# Altium project shpergl_light.PrjPcb
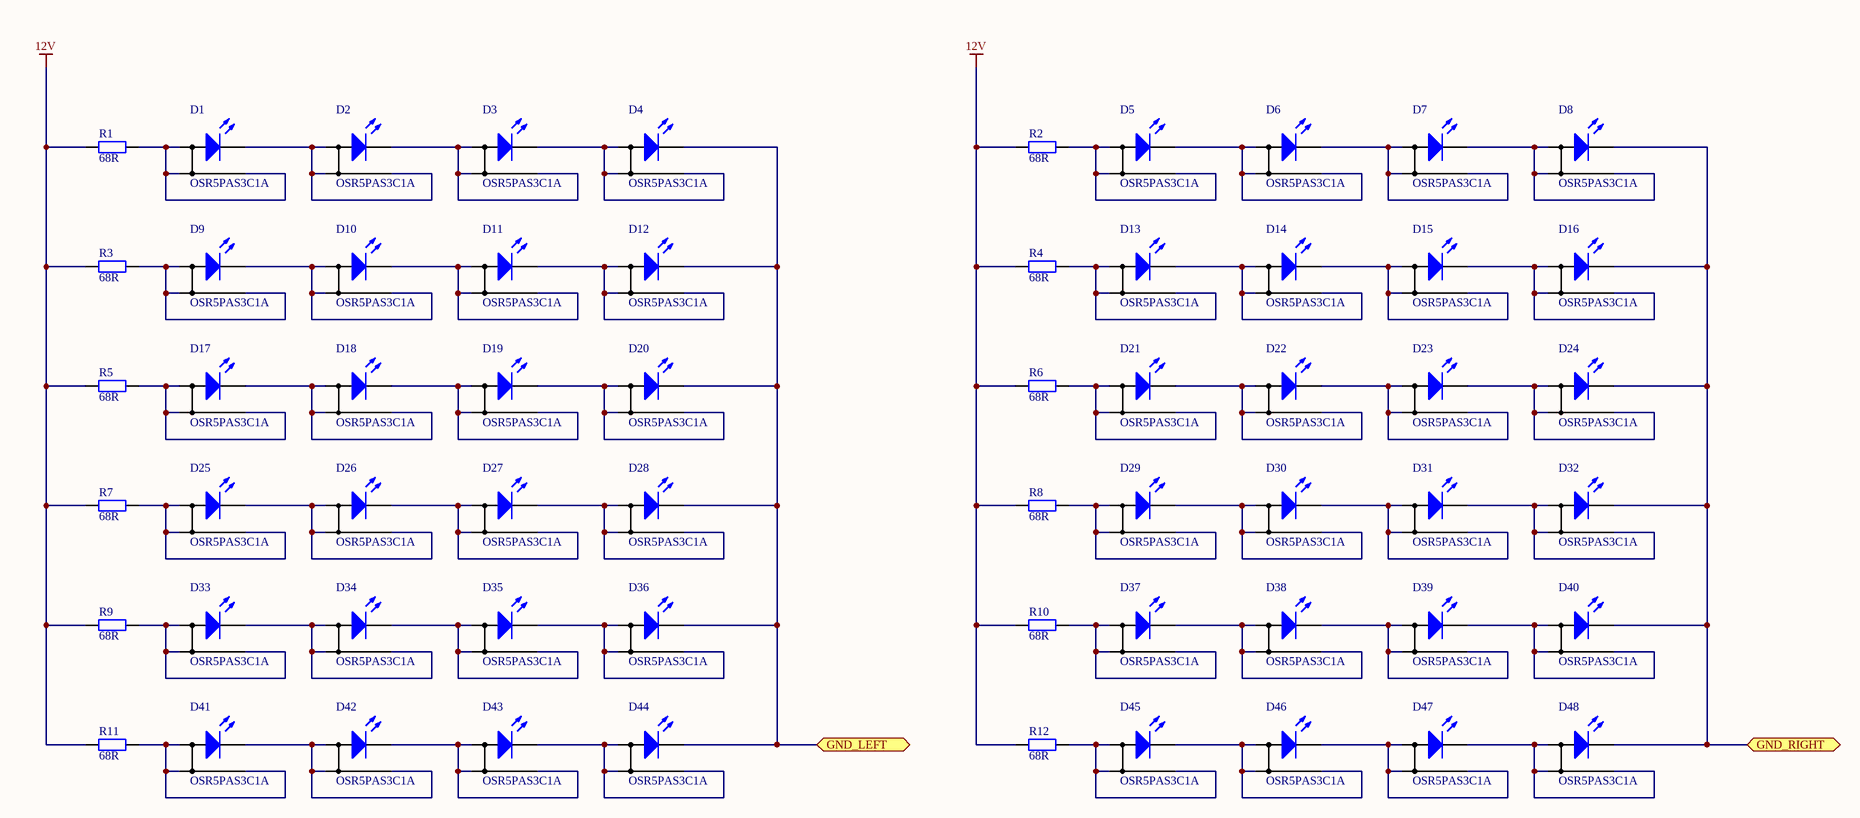
[diagram p0: backlight.SchDoc]
2 sheets, 107 parts. Net scope: flat (ports and power ports of the same name join across sheets).
Board file: backlight.PcbDoc
Sheets:
  backlight.SchDoc
  control_unit.SchDoc

## Sheet backlight.SchDoc
size A3

### Parts
D1  Value1: OSR5PAS3C1A  [DIO_Optosupply_OSR5PAS3C1A]  (hidden comment: DIO_LED_4pin_3528)
D2  Value1: OSR5PAS3C1A  [DIO_Optosupply_OSR5PAS3C1A]  (hidden comment: DIO_LED_4pin_3528)
D3  Value1: OSR5PAS3C1A  [DIO_Optosupply_OSR5PAS3C1A]  (hidden comment: DIO_LED_4pin_3528)
D4  Value1: OSR5PAS3C1A  [DIO_Optosupply_OSR5PAS3C1A]  (hidden comment: DIO_LED_4pin_3528)
D5  Value1: OSR5PAS3C1A  [DIO_Optosupply_OSR5PAS3C1A]  (hidden comment: DIO_LED_4pin_3528)
D6  Value1: OSR5PAS3C1A  [DIO_Optosupply_OSR5PAS3C1A]  (hidden comment: DIO_LED_4pin_3528)
D7  Value1: OSR5PAS3C1A  [DIO_Optosupply_OSR5PAS3C1A]  (hidden comment: DIO_LED_4pin_3528)
D8  Value1: OSR5PAS3C1A  [DIO_Optosupply_OSR5PAS3C1A]  (hidden comment: DIO_LED_4pin_3528)
D9  Value1: OSR5PAS3C1A  [DIO_Optosupply_OSR5PAS3C1A]  (hidden comment: DIO_LED_4pin_3528)
D10  Value1: OSR5PAS3C1A  [DIO_Optosupply_OSR5PAS3C1A]  (hidden comment: DIO_LED_4pin_3528)
D11  Value1: OSR5PAS3C1A  [DIO_Optosupply_OSR5PAS3C1A]  (hidden comment: DIO_LED_4pin_3528)
D12  Value1: OSR5PAS3C1A  [DIO_Optosupply_OSR5PAS3C1A]  (hidden comment: DIO_LED_4pin_3528)
D13  Value1: OSR5PAS3C1A  [DIO_Optosupply_OSR5PAS3C1A]  (hidden comment: DIO_LED_4pin_3528)
D14  Value1: OSR5PAS3C1A  [DIO_Optosupply_OSR5PAS3C1A]  (hidden comment: DIO_LED_4pin_3528)
D15  Value1: OSR5PAS3C1A  [DIO_Optosupply_OSR5PAS3C1A]  (hidden comment: DIO_LED_4pin_3528)
D16  Value1: OSR5PAS3C1A  [DIO_Optosupply_OSR5PAS3C1A]  (hidden comment: DIO_LED_4pin_3528)
D17  Value1: OSR5PAS3C1A  [DIO_Optosupply_OSR5PAS3C1A]  (hidden comment: DIO_LED_4pin_3528)
D18  Value1: OSR5PAS3C1A  [DIO_Optosupply_OSR5PAS3C1A]  (hidden comment: DIO_LED_4pin_3528)
D19  Value1: OSR5PAS3C1A  [DIO_Optosupply_OSR5PAS3C1A]  (hidden comment: DIO_LED_4pin_3528)
D20  Value1: OSR5PAS3C1A  [DIO_Optosupply_OSR5PAS3C1A]  (hidden comment: DIO_LED_4pin_3528)
D21  Value1: OSR5PAS3C1A  [DIO_Optosupply_OSR5PAS3C1A]  (hidden comment: DIO_LED_4pin_3528)
D22  Value1: OSR5PAS3C1A  [DIO_Optosupply_OSR5PAS3C1A]  (hidden comment: DIO_LED_4pin_3528)
D23  Value1: OSR5PAS3C1A  [DIO_Optosupply_OSR5PAS3C1A]  (hidden comment: DIO_LED_4pin_3528)
D24  Value1: OSR5PAS3C1A  [DIO_Optosupply_OSR5PAS3C1A]  (hidden comment: DIO_LED_4pin_3528)
D25  Value1: OSR5PAS3C1A  [DIO_Optosupply_OSR5PAS3C1A]  (hidden comment: DIO_LED_4pin_3528)
D26  Value1: OSR5PAS3C1A  [DIO_Optosupply_OSR5PAS3C1A]  (hidden comment: DIO_LED_4pin_3528)
D27  Value1: OSR5PAS3C1A  [DIO_Optosupply_OSR5PAS3C1A]  (hidden comment: DIO_LED_4pin_3528)
D28  Value1: OSR5PAS3C1A  [DIO_Optosupply_OSR5PAS3C1A]  (hidden comment: DIO_LED_4pin_3528)
D29  Value1: OSR5PAS3C1A  [DIO_Optosupply_OSR5PAS3C1A]  (hidden comment: DIO_LED_4pin_3528)
D30  Value1: OSR5PAS3C1A  [DIO_Optosupply_OSR5PAS3C1A]  (hidden comment: DIO_LED_4pin_3528)
D31  Value1: OSR5PAS3C1A  [DIO_Optosupply_OSR5PAS3C1A]  (hidden comment: DIO_LED_4pin_3528)
D32  Value1: OSR5PAS3C1A  [DIO_Optosupply_OSR5PAS3C1A]  (hidden comment: DIO_LED_4pin_3528)
D33  Value1: OSR5PAS3C1A  [DIO_Optosupply_OSR5PAS3C1A]  (hidden comment: DIO_LED_4pin_3528)
D34  Value1: OSR5PAS3C1A  [DIO_Optosupply_OSR5PAS3C1A]  (hidden comment: DIO_LED_4pin_3528)
D35  Value1: OSR5PAS3C1A  [DIO_Optosupply_OSR5PAS3C1A]  (hidden comment: DIO_LED_4pin_3528)
D36  Value1: OSR5PAS3C1A  [DIO_Optosupply_OSR5PAS3C1A]  (hidden comment: DIO_LED_4pin_3528)
D37  Value1: OSR5PAS3C1A  [DIO_Optosupply_OSR5PAS3C1A]  (hidden comment: DIO_LED_4pin_3528)
D38  Value1: OSR5PAS3C1A  [DIO_Optosupply_OSR5PAS3C1A]  (hidden comment: DIO_LED_4pin_3528)
D39  Value1: OSR5PAS3C1A  [DIO_Optosupply_OSR5PAS3C1A]  (hidden comment: DIO_LED_4pin_3528)
D40  Value1: OSR5PAS3C1A  [DIO_Optosupply_OSR5PAS3C1A]  (hidden comment: DIO_LED_4pin_3528)
D41  Value1: OSR5PAS3C1A  [DIO_Optosupply_OSR5PAS3C1A]  (hidden comment: DIO_LED_4pin_3528)
D42  Value1: OSR5PAS3C1A  [DIO_Optosupply_OSR5PAS3C1A]  (hidden comment: DIO_LED_4pin_3528)
D43  Value1: OSR5PAS3C1A  [DIO_Optosupply_OSR5PAS3C1A]  (hidden comment: DIO_LED_4pin_3528)
D44  Value1: OSR5PAS3C1A  [DIO_Optosupply_OSR5PAS3C1A]  (hidden comment: DIO_LED_4pin_3528)
D45  Value1: OSR5PAS3C1A  [DIO_Optosupply_OSR5PAS3C1A]  (hidden comment: DIO_LED_4pin_3528)
D46  Value1: OSR5PAS3C1A  [DIO_Optosupply_OSR5PAS3C1A]  (hidden comment: DIO_LED_4pin_3528)
D47  Value1: OSR5PAS3C1A  [DIO_Optosupply_OSR5PAS3C1A]  (hidden comment: DIO_LED_4pin_3528)
D48  Value1: OSR5PAS3C1A  [DIO_Optosupply_OSR5PAS3C1A]  (hidden comment: DIO_LED_4pin_3528)
R1  Value1: 68R  [RESC3116X65N]  (hidden comment: RES)
R2  Value1: 68R  [RESC3116X65N]  (hidden comment: RES)
R3  Value1: 68R  [RESC3116X65N]  (hidden comment: RES)
R4  Value1: 68R  [RESC3116X65N]  (hidden comment: RES)
R5  Value1: 68R  [RESC3116X65N]  (hidden comment: RES)
R6  Value1: 68R  [RESC3116X65N]  (hidden comment: RES)
R7  Value1: 68R  [RESC3116X65N]  (hidden comment: RES)
R8  Value1: 68R  [RESC3116X65N]  (hidden comment: RES)
R9  Value1: 68R  [RESC3116X65N]  (hidden comment: RES)
R10  Value1: 68R  [RESC3116X65N]  (hidden comment: RES)
R11  Value1: 68R  [RESC3116X65N]  (hidden comment: RES)
R12  Value1: 68R  [RESC3116X65N]  (hidden comment: RES)

### Ports
GND_LEFT, GND_RIGHT

### Nets
12V: R1.1 R2.1 R3.1 R4.1 R5.1 R6.1 R7.1 R8.1 R9.1 R10.1 R11.1 R12.1
NetD1_1: D1.1(K) D2.2 D2.3(A) D2.4
NetD1_2: D1.2 D1.3(A) D1.4 R1.2
NetD2_1: D2.1(K) D3.2 D3.3(A) D3.4
NetD3_1: D3.1(K) D4.2 D4.3(A) D4.4
NetD4_1: D4.1(K) D12.1(K) D20.1(K) D28.1(K) D36.1(K) D44.1(K) ; port GND_LEFT
NetD5_1: D5.1(K) D6.2 D6.3(A) D6.4
NetD5_2: D5.2 D5.3(A) D5.4 R2.2
NetD6_1: D6.1(K) D7.2 D7.3(A) D7.4
NetD7_1: D7.1(K) D8.2 D8.3(A) D8.4
NetD8_1: D8.1(K) D16.1(K) D24.1(K) D32.1(K) D40.1(K) D48.1(K) ; port GND_RIGHT
NetD9_1: D9.1(K) D10.2 D10.3(A) D10.4
NetD9_2: D9.2 D9.3(A) D9.4 R3.2
NetD10_1: D10.1(K) D11.2 D11.3(A) D11.4
NetD11_1: D11.1(K) D12.2 D12.3(A) D12.4
NetD13_1: D13.1(K) D14.2 D14.3(A) D14.4
NetD13_2: D13.2 D13.3(A) D13.4 R4.2
NetD14_1: D14.1(K) D15.2 D15.3(A) D15.4
NetD15_1: D15.1(K) D16.2 D16.3(A) D16.4
NetD17_1: D17.1(K) D18.2 D18.3(A) D18.4
NetD17_2: D17.2 D17.3(A) D17.4 R5.2
NetD18_1: D18.1(K) D19.2 D19.3(A) D19.4
NetD19_1: D19.1(K) D20.2 D20.3(A) D20.4
NetD21_1: D21.1(K) D22.2 D22.3(A) D22.4
NetD21_2: D21.2 D21.3(A) D21.4 R6.2
NetD22_1: D22.1(K) D23.2 D23.3(A) D23.4
NetD23_1: D23.1(K) D24.2 D24.3(A) D24.4
NetD25_1: D25.1(K) D26.2 D26.3(A) D26.4
NetD25_2: D25.2 D25.3(A) D25.4 R7.2
NetD26_1: D26.1(K) D27.2 D27.3(A) D27.4
NetD27_1: D27.1(K) D28.2 D28.3(A) D28.4
NetD29_1: D29.1(K) D30.2 D30.3(A) D30.4
NetD29_2: D29.2 D29.3(A) D29.4 R8.2
NetD30_1: D30.1(K) D31.2 D31.3(A) D31.4
NetD31_1: D31.1(K) D32.2 D32.3(A) D32.4
NetD33_1: D33.1(K) D34.2 D34.3(A) D34.4
NetD33_2: D33.2 D33.3(A) D33.4 R9.2
NetD34_1: D34.1(K) D35.2 D35.3(A) D35.4
NetD35_1: D35.1(K) D36.2 D36.3(A) D36.4
NetD37_1: D37.1(K) D38.2 D38.3(A) D38.4
NetD37_2: D37.2 D37.3(A) D37.4 R10.2
NetD38_1: D38.1(K) D39.2 D39.3(A) D39.4
NetD39_1: D39.1(K) D40.2 D40.3(A) D40.4
NetD41_1: D41.1(K) D42.2 D42.3(A) D42.4
NetD41_2: D41.2 D41.3(A) D41.4 R11.2
NetD42_1: D42.1(K) D43.2 D43.3(A) D43.4
NetD43_1: D43.1(K) D44.2 D44.3(A) D44.4
NetD45_1: D45.1(K) D46.2 D46.3(A) D46.4
NetD45_2: D45.2 D45.3(A) D45.4 R12.2
NetD46_1: D46.1(K) D47.2 D47.3(A) D47.4
NetD47_1: D47.1(K) D48.2 D48.3(A) D48.4

### Library data of the parts
D1-D48 = 03_00092: High Luminous PLCC4 Power Top SMD LED; Manufacturer: OptoSupply; AutoId: 108; Value2: 2..2,8V 50mA 1560-1800 mcd; DeviceType: diode; Id: 03_00092; Value3: LED; Manufacturer PN: OSR5PAS3C1A; SubType: LED; Status: 0 - Unchecked; MountType: SMD; ComponentLink1Description: Datasheet; ComponentLink1URL: X:\01_Datasheets\DIO_Optosupply_OSR5PAS3C1A.pdf; ComponentLink2Description: ComponentVerificationSheet; ComponentLink2URL: X:\02_ComponentVerificationSheets\; Supplier 1: rcs; Supplier Part Number 1: 139993
R1-R12 = 15_00388: 1% SMT Resistor 1206; Manufacturer: Yageo; Manufacturer PN: RC1206FR-0768R; AutoId: 388; Value2: 0W25; SubType: Metal film; Id: 15_00388; DeviceType: resistor; Status: 0 - Unchecked; MountType: SMT; ComponentLink1Description: Datasheet; ComponentLink1URL: X:\01_Datasheets\RES_YAGEO_RC1206FR.pdf; Supplier 1: Farnell

## Sheet control_unit.SchDoc
size A3
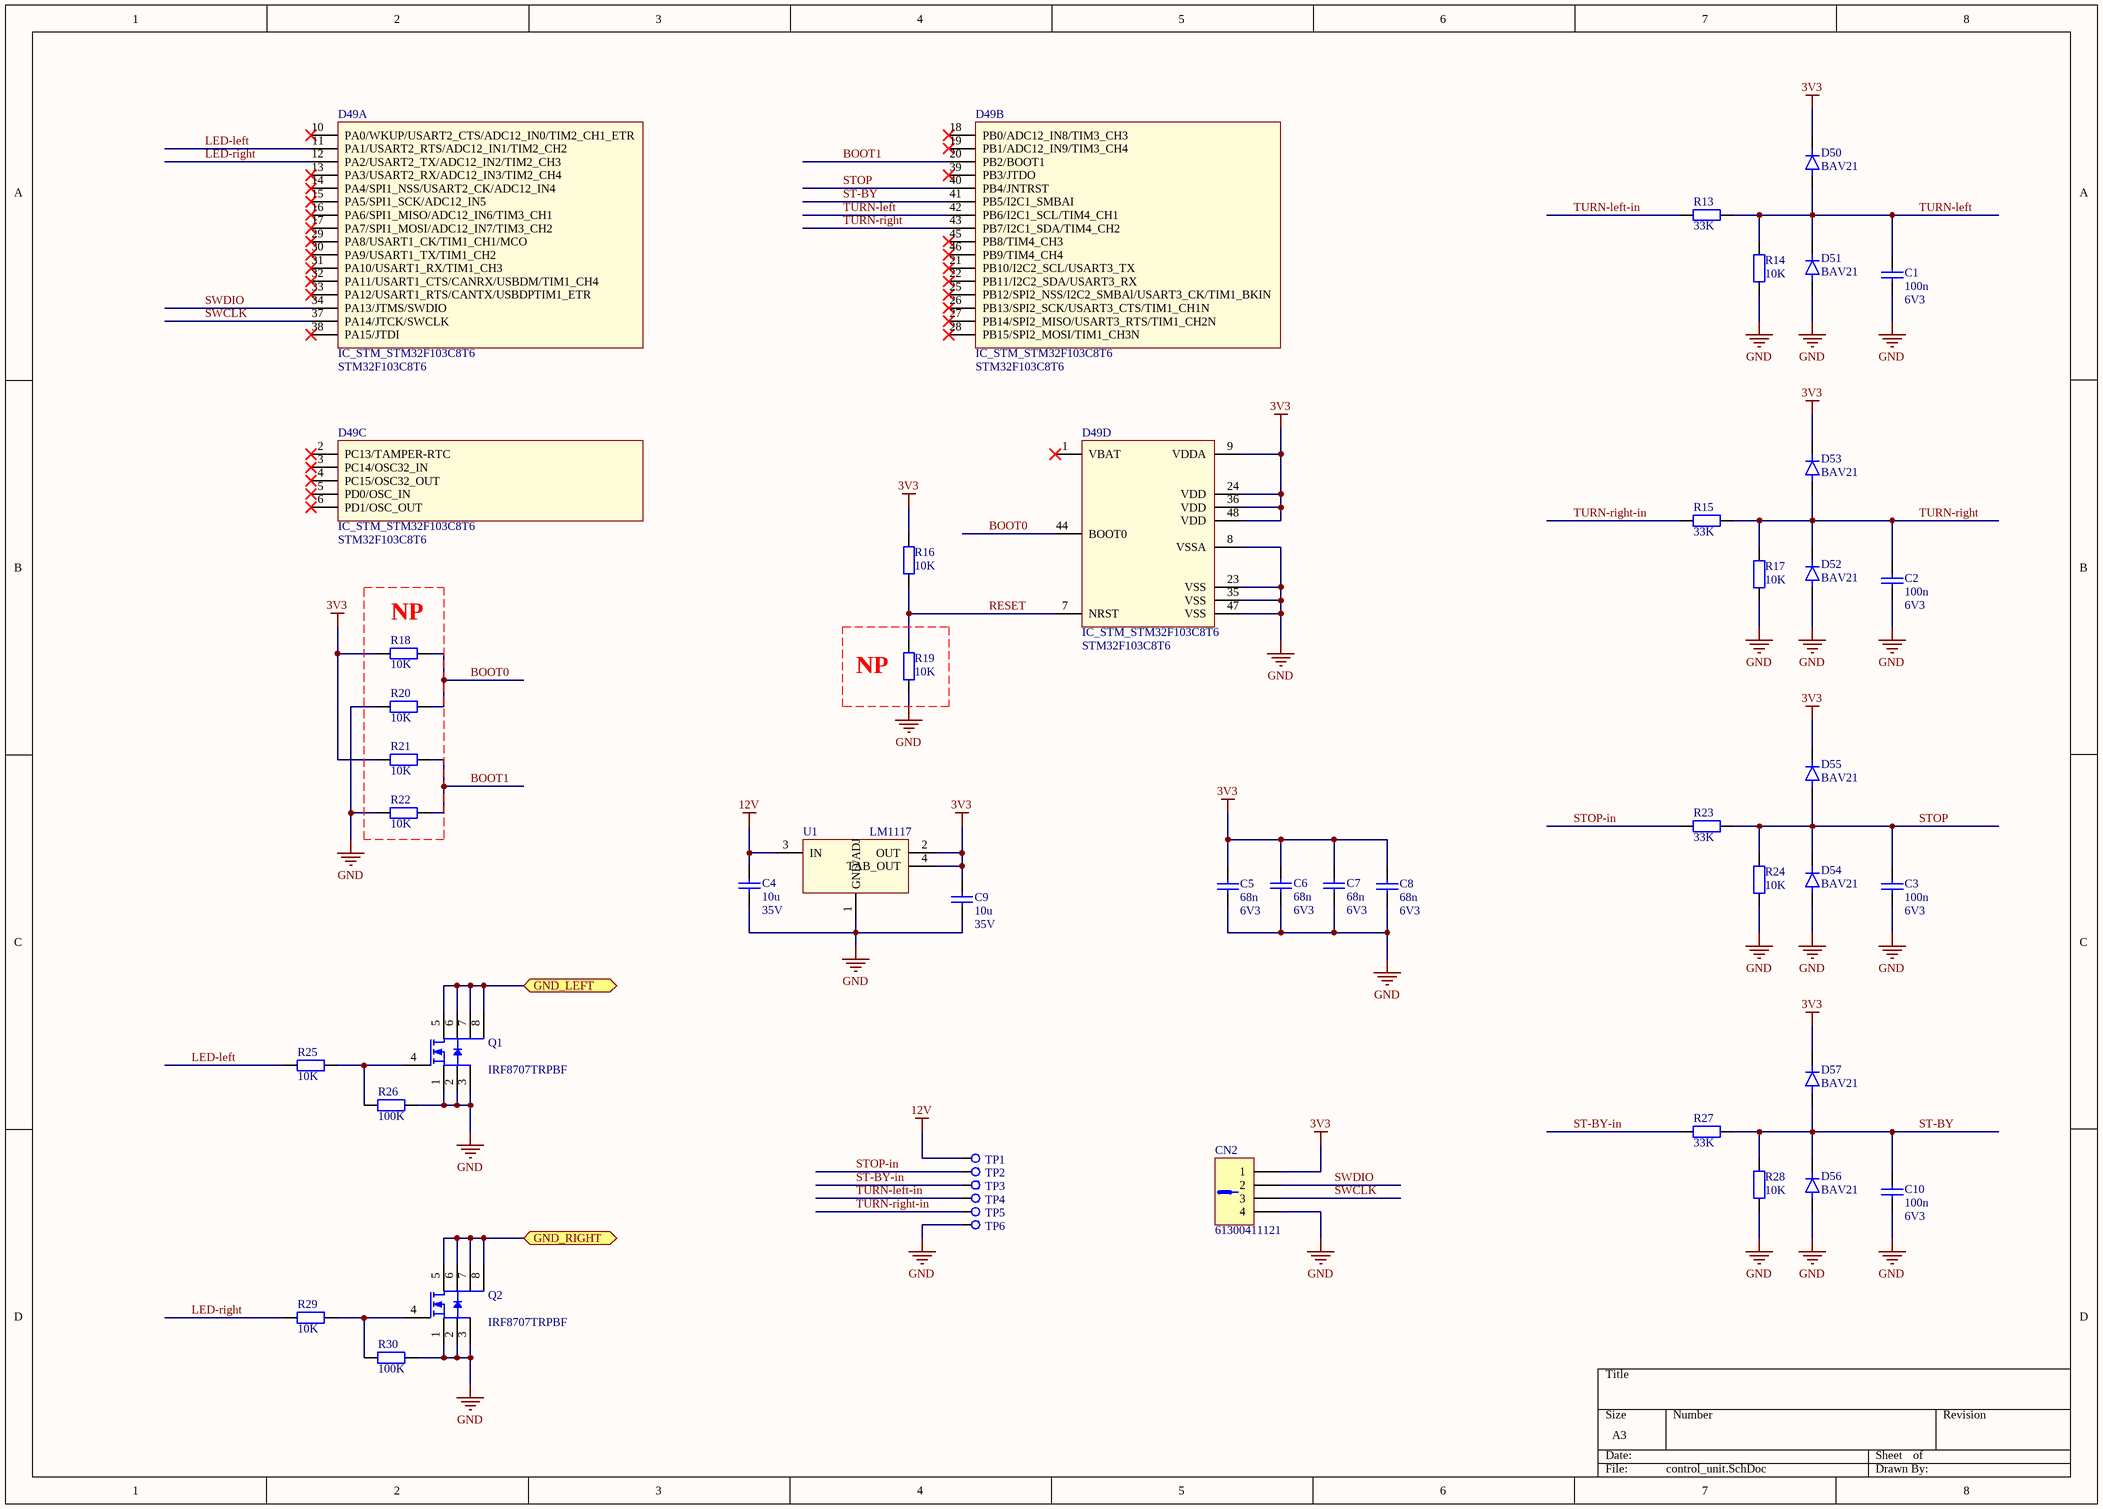
[diagram p1: control_unit.SchDoc]

### Parts
C1  Value1: 100n  Value2: 6V3  [CAPC2012X88N]  (hidden comment: CAP)
C2  Value1: 100n  Value2: 6V3  [CAPC2012X88N]  (hidden comment: CAP)
C3  Value1: 100n  Value2: 6V3  [CAPC2012X88N]  (hidden comment: CAP)
C4  Value1: 10u  Value2: 35V  [CAPC3216X18N]  (hidden comment: CAP)
C5  Value1: 68n  Value2: 6V3  [CAPC2012X100N]  (hidden comment: CAP)
C6  Value1: 68n  Value2: 6V3  [CAPC2012X100N]  (hidden comment: CAP)
C7  Value1: 68n  Value2: 6V3  [CAPC2012X100N]  (hidden comment: CAP)
C8  Value1: 68n  Value2: 6V3  [CAPC2012X100N]  (hidden comment: CAP)
C9  Value1: 10u  Value2: 35V  [CAPC3216X18N]  (hidden comment: CAP)
C10  Value1: 100n  Value2: 6V3  [CAPC2012X88N]  (hidden comment: CAP)
CN2  Value1: 61300411121  [CN_WURTH_61300411121]  (hidden comment: CN_1X4M)
D49  IC_STM_STM32F103C8T6  Value1: STM32F103C8T6  [TSQFP50P900X900X160-48N]  (parts A,B,C,D of 4)
D50  Value1: BAV21  [SODFL370X136-2M]  (hidden comment: DIO)
D51  Value1: BAV21  [SODFL370X136-2M]  (hidden comment: DIO)
D52  Value1: BAV21  [SODFL370X136-2M]  (hidden comment: DIO)
D53  Value1: BAV21  [SODFL370X136-2M]  (hidden comment: DIO)
D54  Value1: BAV21  [SODFL370X136-2M]  (hidden comment: DIO)
D55  Value1: BAV21  [SODFL370X136-2M]  (hidden comment: DIO)
D56  Value1: BAV21  [SODFL370X136-2M]  (hidden comment: DIO)
D57  Value1: BAV21  [SODFL370X136-2M]  (hidden comment: DIO)
Q1  Value1: IRF8707TRPBF  [SOIC127P600X175-8N]  (hidden comment: TRS_INFINEON_IRF8707TRPBF)
Q2  Value1: IRF8707TRPBF  [SOIC127P600X175-8N]  (hidden comment: TRS_INFINEON_IRF8707TRPBF)
R13  Value1: 33K  [RESC2012X60N]  (hidden comment: RES)
R14  Value1: 10K  [RESC2012X60N]  (hidden comment: RES)
R15  Value1: 33K  [RESC2012X60N]  (hidden comment: RES)
R16  Value1: 10K  [RESC2012X60N]  (hidden comment: RES)
R17  Value1: 10K  [RESC2012X60N]  (hidden comment: RES)
R18  Value1: 10K  [RESC2012X60N]  (hidden comment: RES)
R19  Value1: 10K  [RESC2012X60N]  (hidden comment: RES)
R20  Value1: 10K  [RESC2012X60N]  (hidden comment: RES)
R21  Value1: 10K  [RESC2012X60N]  (hidden comment: RES)
R22  Value1: 10K  [RESC2012X60N]  (hidden comment: RES)
R23  Value1: 33K  [RESC2012X60N]  (hidden comment: RES)
R24  Value1: 10K  [RESC2012X60N]  (hidden comment: RES)
R25  Value1: 10K  [RESC2012X60N]  (hidden comment: RES)
R26  Value1: 100K  [RESC2012X60N]  (hidden comment: RES)
R27  Value1: 33K  [RESC2012X60N]  (hidden comment: RES)
R28  Value1: 10K  [RESC2012X60N]  (hidden comment: RES)
R29  Value1: 10K  [RESC2012X60N]  (hidden comment: RES)
R30  Value1: 100K  [RESC2012X60N]  (hidden comment: RES)
TP1  MSC_TP  [MSC_TP_THT1MM]  (value not drawn)  (no BOM)
TP2  MSC_TP  [MSC_TP_THT1MM]  (value not drawn)  (no BOM)
TP3  MSC_TP  [MSC_TP_THT1MM]  (value not drawn)  (no BOM)
TP4  MSC_TP  [MSC_TP_THT1MM]  (value not drawn)  (no BOM)
TP5  MSC_TP  [MSC_TP_THT1MM]  (value not drawn)  (no BOM)
TP6  MSC_TP  [MSC_TP_THT1MM]  (value not drawn)  (no BOM)
U1  Value1: LM1117  [IC_TI_LM1117]  (hidden comment: IC_TI_LM1117)

### Ports
GND_LEFT, GND_RIGHT

### Nets
3V3: C5.2 C6.2 C7.2 C8.2 C9.2 CN2.1 D49.9(VDDA) D49.24(VDD) D49.36(VDD) D49.48(VDD) D50.1(K) D53.1(K) D55.1(K) D57.1(K) R16.2 R18.1 R21.1 U1.2(OUT) U1.4(TAB_OUT)
12V: C4.2 TP1.1 U1.3(IN)
GND: C1.1 C2.1 C3.1 C4.1 C5.1 C6.1 C7.1 C8.1 C9.1 C10.1 CN2.4 D49.8(VSSA) D49.23(VSS) D49.35(VSS) D49.47(VSS) D51.2(A) D52.2(A) D54.2(A) D56.2(A) Q1.1(S) Q1.2(S) Q1.3(D) Q2.1(S) Q2.2(S) Q2.3(D) R14.1 R17.2 R19.1 R20.1 R22.1 R24.2 R26.2 R28.1 R30.2 TP6.1 U1.1(GND/ADJ)
BOOT0: D49.44(BOOT0) R18.2 R20.2
BOOT1: D49.20(PB2/BOOT1) R21.2 R22.2
LED-left: D49.11(PA1/USART2_RTS/ADC12_IN1/TIM2_CH2) R25.2
LED-right: D49.12(PA2/USART2_TX/ADC12_IN2/TIM2_CH3) R29.2
RESET: D49.7(NRST) R16.1 R19.2
ST-BY: C10.2 D49.41(PB5/I2C1_SMBAI) D56.1(K) D57.2(A) R27.2 R28.2
ST-BY-in: R27.1 TP3.1
STOP: C3.2 D49.40(PB4/JNTRST) D54.1(K) D55.2(A) R23.2 R24.1
STOP-in: R23.1 TP2.1
SWCLK: CN2.3 D49.37(PA14/JTCK/SWCLK)
SWDIO: CN2.2 D49.34(PA13/JTMS/SWDIO)
TURN-left: C1.2 D49.42(PB6/I2C1_SCL/TIM4_CH1) D50.2(A) D51.1(K) R13.2 R14.2
TURN-left-in: R13.1 TP4.1
TURN-right: C2.2 D49.43(PB7/I2C1_SDA/TIM4_CH2) D52.1(K) D53.2(A) R15.2 R17.1
TURN-right-in: R15.1 TP5.1
NetD4_1: Q1.5(D) Q1.6(D) Q1.7(D) Q1.8(D) ; port GND_LEFT
NetD8_1: Q2.5(D) Q2.6(D) Q2.7(D) Q2.8(D) ; port GND_RIGHT
NetQ1_4: Q1.4(G) R25.1 R26.1
NetQ2_4: Q2.4(G) R29.1 R30.1

Not connected (* = marked no-connect by the designer): D49 1(VBAT)* 2(PC13/TAMPER-RTC)* 3(PC14/OSC32_IN)* 4(PC15/OSC32_OUT)* 5(PD0/OSC_IN)* 6(PD1/OSC_OUT)* 10(PA0/WKUP/USART2_CTS/ADC12_IN0/TIM2_CH1_ETR)* 13(PA3/USART2_RX/ADC12_IN3/TIM2_CH4)* 14(PA4/SPI1_NSS/USART2_CK/ADC12_IN4)* 15(PA5/SPI1_SCK/ADC12_IN5)* 16(PA6/SPI1_MISO/ADC12_IN6/TIM3_CH1)* 17(PA7/SPI1_MOSI/ADC12_IN7/TIM3_CH2)* 18(PB0/ADC12_IN8/TIM3_CH3)* 19(PB1/ADC12_IN9/TIM3_CH4)* 21(PB10/I2C2_SCL/USART3_TX)* 22(PB11/I2C2_SDA/USART3_RX)* 25(PB12/SPI2_NSS/I2C2_SMBAl/USART3_CK/TIM1_BKIN)* 26(PB13/SPI2_SCK/USART3_CTS/TIM1_CH1N)* 27(PB14/SPI2_MISO/USART3_RTS/TIM1_CH2N)* 28(PB15/SPI2_MOSI/TIM1_CH3N)* 29(PA8/USART1_CK/TIM1_CH1/MCO)* 30(PA9/USART1_TX/TIM1_CH2)* 31(PA10/USART1_RX/TIM1_CH3)* 32(PA11/USART1_CTS/CANRX/USBDM/TIM1_CH4)* 33(PA12/USART1_RTS/CANTX/USBDPTIM1_ETR)* 38(PA15/JTDI)* 39(PB3/JTDO)* 45(PB8/TIM4_CH3)* 46(PB9/TIM4_CH4)*

### Notes on the sheet
- (near R18) NP
- (near R19) NP

### Library data of the parts
C1-C3 C10 = 01_00637: X7R 10% 0805; Manufacturer: KEMET; Manufacturer PN: C0805C104K9RACTU; AutoId: 637; DeviceType: capacitor; SubType: Ceramic; Id: 01_00637; Status: 2 - Checked and Approved; MountType: SMT; ComponentLink1URL: X:\01_Datasheets\CAP_KEMET_CxxxxCxxxXxRAC.pdf; Supplier 1: Farnell; Supplier Part Number 1: 80-C0805C104K9R; ComponentLink1Description: Datasheet
C4 C9 = 01_01484: MURATA - GRM31CR6YA106KA12L - CAP, MLCC, X5R, 10UF, 35V, 1206; AutoId: 1484; DeviceType: capacitor; SubType: Ceramic; Id: 01_01484; Manufacturer: Murata; Manufacturer PN: GRM31CR6YA106KA12L; Status: 2 - Checked and Approved; MountType: SMD; ComponentLink1URL: X:\01_dataSheets\CAP_MURATA_GRM31CR6YA106KA12L.pdf; Supplier 1: Farnell; Supplier Part Number 1: 1797011; ComponentLink1Description: Datasheet
C5-C8 = 01_00635: X7R 10% 0805; Manufacturer: KEMET; Manufacturer PN: C0805C683K9RACTU; AutoId: 635; DeviceType: capacitor; SubType: Ceramic; Id: 01_00635; Status: 2 - Checked and Approved; MountType: SMT; ComponentLink1URL: X:\01_Datasheets\CAP_KEMET_CxxxxCxxxXxRAC.pdf; Supplier 1: Farnell; ComponentLink1Description: Datasheet
CN2 = 02_00034: 4 pin male pin header, pitch 2.54mm; Manufacturer: Wurth Electronics; AutoId: 36; Value3: 4 pin; DeviceType: Connector_4; SubType: 1x4; Id: 02_00034; Manufacturer PN: 61300411121; Status: 2 - Checked and Approved; MountType: THT; ComponentLink1Description: Datasheet; ComponentLink1URL: X:\01_Datasheets\CN_WURTH_6130xx11121.pdf; ComponentLink2Description: ComponentVerificationSheet; ComponentLink2URL: X:\02_ComponentVerificationSheets\CN_WURTH_61300411121_ComponentVerificationSheet.xlsx; Supplier 1: Wurth; Supplier Part Number 1: 61300411121
D49 = 07_00285: MCU 32BIT Cortex M3 64KB 20KB RAM 2X12 ADC; Manufacturer: STM; AutoId: 292; Value2: Microcontroller; Value3: ARM 32bit; DeviceType: IC; Id: 07_00285; Manufacturer PN: STM32F103C8T6; Status: 0 - Unchecked; MountType: SMT; ComponentLink1Description: Datasheet; ComponentLink1URL: X:\01_Datasheets\IC_STM_STM32F103C8T6.pdf; ComponentLink2Description: ComponentVerificationSheet; ComponentLink2URL: X:\02_ComponentVerificationSheets\; Supplier 1: Mouser; Supplier Part Number 1: 511-STM32F103C8T6
D50-D57 = 03_00081: Diodes - General Purpose, Power, Switching 250V 625mA 1A IFSM; Manufacturer: Vishay; Manufacturer PN: BAV21W-E3-08; AutoId: 91; Value2: 250V 250mA; Value3: Diode; Id: 03_00081; DeviceType: diode; SubType: general; Status: 0 - Unchecked; MountType: SMD; ComponentLink1Description: Datasheet; ComponentLink1URL: X:\01_Datasheets\DIO_Vishay_BAV21.pdf; ComponentLink2Description: ComponentVerificationSheet; ComponentLink2URL: X:\02_ComponentVerificationSheets\; Supplier 1: Mouser; Supplier Part Number 1: 78-BAV21W-E3-08
Q1 Q2 = 19_00042: MOSFET MOSFT 30V 11A 11.9mOhm 6.2nC Qg; AutoId: 48; Value2: 30V 11A; DeviceType: transistor; SubType: N MOSFET; Id: 19_00042; Manufacturer: Infineon; Manufacturer PN: IRF8707TRPBF; Status: 0 - Unchecked; MountType: SMT; ComponentLink1Description: Datasheet; ComponentLink1URL: X:\01_Datasheets\TRS_INFINEON_IRF8707TRPBF.pdf; ComponentLink2Description: ComponentVerificationSheet; ComponentLink2URL: X:\02_ComponentVerificationSheets\; Supplier 1: Mouser; Supplier Part Number 1: 942-IRF8707TRPBF
R13 R15 R23 R27 = 15_00347: RESISTOR, 0805, 33K, 1%, SMD; Manufacturer: Yageo; Manufacturer PN: RC0805FR-0733K; AutoId: 347; Value2: 0W125; SubType: Metal film; Id: 15_00347; DeviceType: resistor; Status: 0 - Unchecked; MountType: SMT; ComponentLink1Description: Datasheet; ComponentLink1URL: X:\01_Datasheets\RES_YAGEO_RC0805FR.pdf; Supplier 1: Farnell
R14 R16-R22 R24 R25 R28 R29 = 15_00341: RESISTOR, 0805, 10K, 1%, SMD; Manufacturer: Yageo; Manufacturer PN: RC0805FR-0710K; AutoId: 341; Value2: 0W125; SubType: Metal film; Id: 15_00341; DeviceType: resistor; Status: 0 - Unchecked; MountType: SMT; ComponentLink1Description: Datasheet; ComponentLink1URL: X:\01_Datasheets\RES_YAGEO_RC0805FR.pdf; Supplier 1: Farnell
R26 R30 = 15_00353: RESISTOR, 0805, 100K, 1%, SMD; Manufacturer: Yageo; Manufacturer PN: RC0805FR-07100K; AutoId: 353; Value2: 0W125; SubType: Metal film; Id: 15_00353; DeviceType: resistor; Status: 0 - Unchecked; MountType: SMT; ComponentLink1Description: Datasheet; ComponentLink1URL: X:\01_Datasheets\RES_YAGEO_RC0805FR.pdf; Supplier 1: Farnell
TP1-TP6 = 12_00001: With Hole for 1 header pin; Value1: TESTPOINT_TH; AutoId: 2; Value2: NO BUY; Id: 12_00001; Status: 0 - Unchecked; MountType: THT; ComponentLink1Description: Datasheet; ComponentLink1URL: X:\01_Datasheets\; ComponentLink2Description: ComponentVerificationSheet; ComponentLink2URL: X:\02_ComponentVerificationSheets\
U1 = 07_00244: LDO Voltage Regulators 800MA LDO LINEAR REG; Manufacturer: TI; Manufacturer PN: LM1117MPX-3.3/NOPB; AutoId: 242; Value3: 3V3; Id: 07_00244; Value2: LDO; DeviceType: LDO; Status: 0 - Unchecked; MountType: SMT; ComponentLink1Description: Datasheet; ComponentLink1URL: X:\01_Datasheets\IC_TI_LM1117.pdf; ComponentLink2Description: ComponentVerificationSheet; ComponentLink2URL: X:\02_ComponentVerificationSheets\; Supplier 1: Mouser; Supplier Part Number 1: 926-LM1117MPX3.3NOPB

## Nets that join several sheets
12V: backlight (12 pins), control_unit (C4.2 TP1.1 U1.3)
NetD4_1: backlight (6 pins), control_unit (Q1.5 Q1.6 Q1.7 Q1.8)
NetD8_1: backlight (6 pins), control_unit (Q2.5 Q2.6 Q2.7 Q2.8)